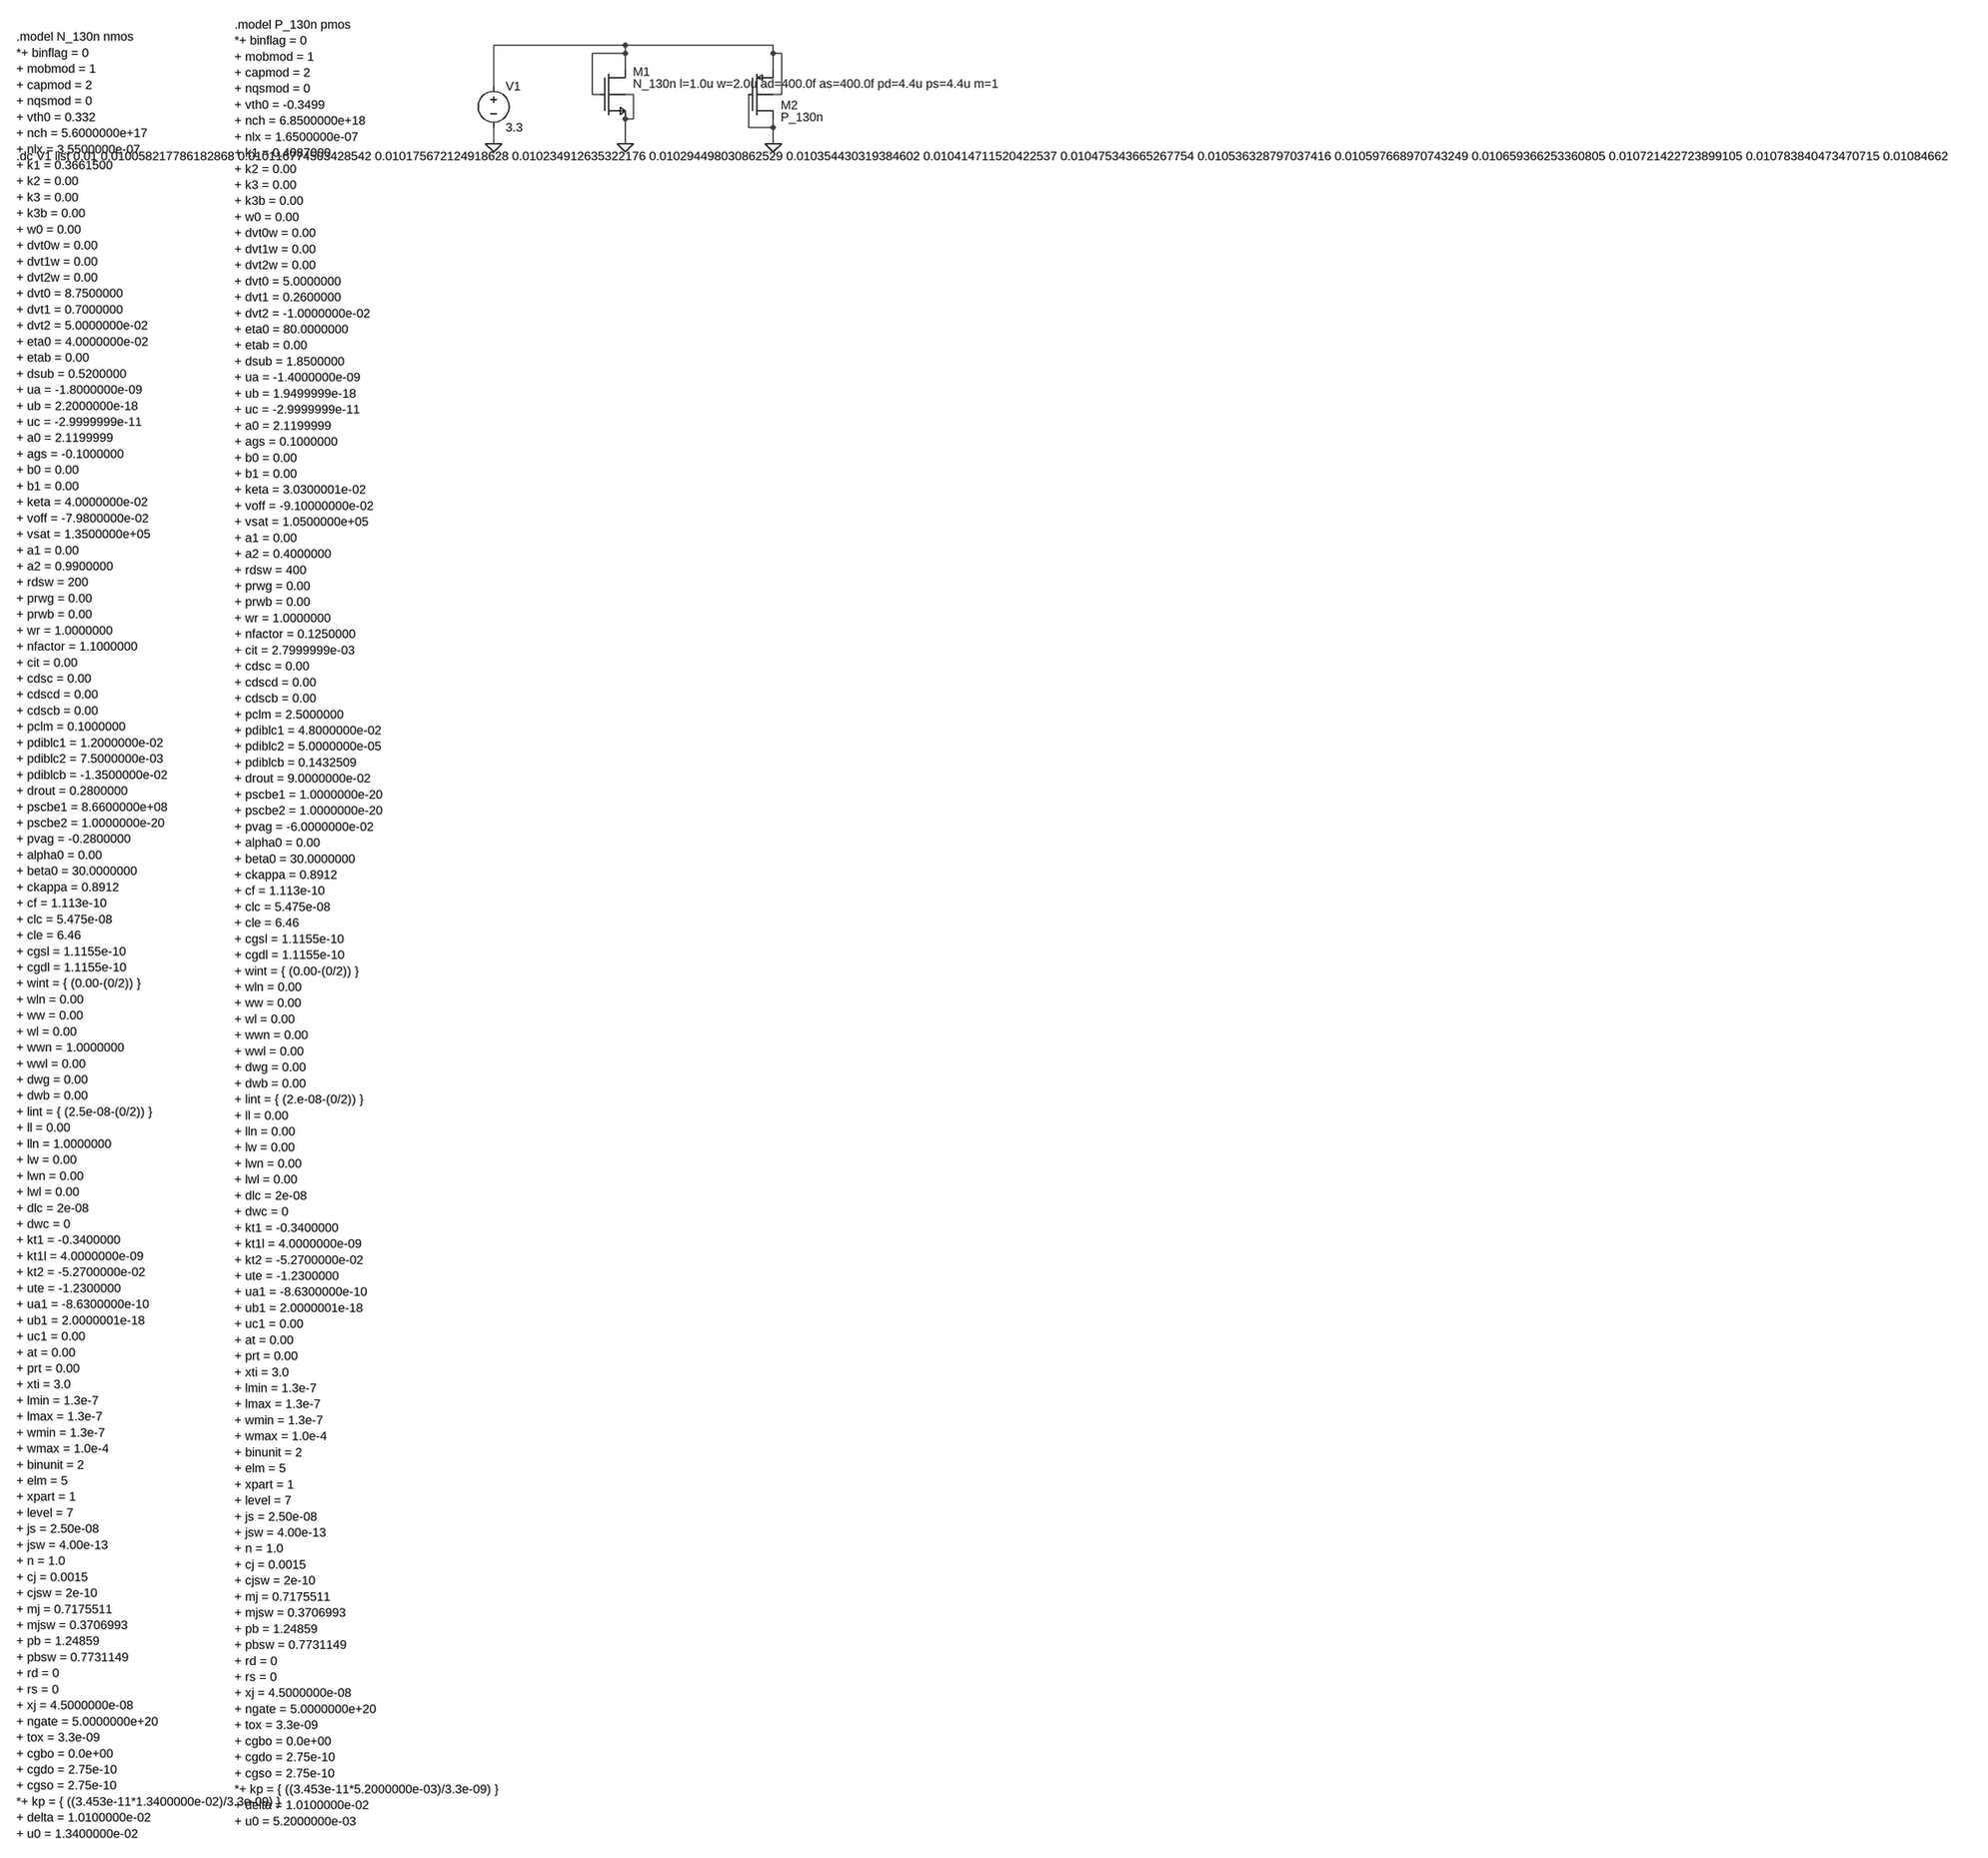
[diagram p0: schematic ekvParameterExtractionEdited.asc]
ekvParameterExtractionEdited.asc, the LTspice schematic file:
Version 4
SHEET 1 880 3184
WIRE 272 32 16 32
WIRE 560 32 272 32
WIRE 272 48 272 32
WIRE 272 48 208 48
WIRE 560 48 560 32
WIRE 576 48 560 48
WIRE 272 80 272 48
WIRE 560 80 560 48
WIRE 16 112 16 32
WIRE 208 128 208 48
WIRE 224 128 208 128
WIRE 288 128 272 128
WIRE 576 128 576 48
WIRE 576 128 560 128
WIRE 288 176 288 128
WIRE 288 176 272 176
WIRE 512 192 512 128
WIRE 560 192 560 176
WIRE 560 192 512 192
WIRE 16 224 16 192
WIRE 272 224 272 176
WIRE 560 224 560 192
FLAG 16 224 0
FLAG 272 224 0
FLAG 560 224 0
SYMBOL voltage 16 96 R0
WINDOW 123 0 0 Left 0
WINDOW 39 0 0 Left 0
SYMATTR InstName V1
SYMATTR Value 3.3
SYMBOL nmosb 224 80 R0
SYMATTR InstName M1
SYMATTR Value2 l=1.0u w=2.0u ad=400.0f as=400.0f pd=4.4u ps=4.4u m=1
SYMATTR Value N_130n l=1.0u w=2.0u ad=400.0f as=400.0f pd=4.4u ps=4.4u m=1
SYMBOL pmosb 512 80 R0
WINDOW 0 63 69 Left 2
SYMATTR InstName M2
SYMATTR Value2 l=1.0u w=6.0u ad=1.2p as=1.2p pd=12.4u ps=12.4u m=1
SYMATTR Value P_130n
TEXT -912 16 Left 2 !.model N_130n nmos \n*+ binflag = 0 \n+ mobmod = 1 \n+ capmod = 2 \n+ nqsmod = 0 \n+ vth0 = 0.332 \n+ nch = 5.6000000e+17 \n+ nlx = 3.5500000e-07 \n+ k1 = 0.3661500 \n+ k2 = 0.00 \n+ k3 = 0.00 \n+ k3b = 0.00 \n+ w0 = 0.00 \n+ dvt0w = 0.00 \n+ dvt1w = 0.00 \n+ dvt2w = 0.00 \n+ dvt0 = 8.7500000 \n+ dvt1 = 0.7000000 \n+ dvt2 = 5.0000000e-02 \n+ eta0 = 4.0000000e-02 \n+ etab = 0.00 \n+ dsub = 0.5200000 \n+ ua = -1.8000000e-09 \n+ ub = 2.2000000e-18 \n+ uc = -2.9999999e-11 \n+ a0 = 2.1199999 \n+ ags = -0.1000000 \n+ b0 = 0.00 \n+ b1 = 0.00 \n+ keta = 4.0000000e-02 \n+ voff = -7.9800000e-02 \n+ vsat = 1.3500000e+05 \n+ a1 = 0.00 \n+ a2 = 0.9900000 \n+ rdsw = 200 \n+ prwg = 0.00 \n+ prwb = 0.00 \n+ wr = 1.0000000 \n+ nfactor = 1.1000000 \n+ cit = 0.00 \n+ cdsc = 0.00 \n+ cdscd = 0.00 \n+ cdscb = 0.00 \n+ pclm = 0.1000000 \n+ pdiblc1 = 1.2000000e-02 \n+ pdiblc2 = 7.5000000e-03 \n+ pdiblcb = -1.3500000e-02 \n+ drout = 0.2800000 \n+ pscbe1 = 8.6600000e+08 \n+ pscbe2 = 1.0000000e-20 \n+ pvag = -0.2800000 \n+ alpha0 = 0.00 \n+ beta0 = 30.0000000 \n+ ckappa = 0.8912 \n+ cf = 1.113e-10 \n+ clc = 5.475e-08 \n+ cle = 6.46 \n+ cgsl = 1.1155e-10 \n+ cgdl = 1.1155e-10 \n+ wint = { (0.00-(0/2)) } \n+ wln = 0.00 \n+ ww = 0.00 \n+ wl = 0.00 \n+ wwn = 1.0000000 \n+ wwl = 0.00 \n+ dwg = 0.00 \n+ dwb = 0.00 \n+ lint = { (2.5e-08-(0/2)) } \n+ ll = 0.00 \n+ lln = 1.0000000 \n+ lw = 0.00 \n+ lwn = 0.00 \n+ lwl = 0.00 \n+ dlc = 2e-08 \n+ dwc = 0 \n+ kt1 = -0.3400000 \n+ kt1l = 4.0000000e-09 \n+ kt2 = -5.2700000e-02 \n+ ute = -1.2300000 \n+ ua1 = -8.6300000e-10 \n+ ub1 = 2.0000001e-18 \n+ uc1 = 0.00 \n+ at = 0.00 \n+ prt = 0.00 \n+ xti = 3.0 \n+ lmin = 1.3e-7 \n+ lmax = 1.3e-7 \n+ wmin = 1.3e-7 \n+ wmax = 1.0e-4 \n+ binunit = 2 \n+ elm = 5\n+ xpart = 1 \n+ level = 7 \n+ js = 2.50e-08 \n+ jsw = 4.00e-13 \n+ n = 1.0 \n+ cj = 0.0015 \n+ cjsw = 2e-10 \n+ mj = 0.7175511 \n+ mjsw = 0.3706993 \n+ pb = 1.24859 \n+ pbsw = 0.7731149 \n+ rd = 0 \n+ rs = 0 \n+ xj = 4.5000000e-08 \n+ ngate = 5.0000000e+20 \n+ tox = 3.3e-09 \n+ cgbo = 0.0e+00 \n+ cgdo = 2.75e-10 \n+ cgso = 2.75e-10 \n*+ kp = { ((3.453e-11*1.3400000e-02)/3.3e-09) } \n+ delta = 1.0100000e-02 \n+ u0 = 1.3400000e-02
TEXT -488 -8 Left 2 !.model P_130n pmos \n*+ binflag = 0 \n+ mobmod = 1 \n+ capmod = 2 \n+ nqsmod = 0 \n+ vth0 = -0.3499 \n+ nch = 6.8500000e+18 \n+ nlx = 1.6500000e-07 \n+ k1 = 0.4087000 \n+ k2 = 0.00 \n+ k3 = 0.00 \n+ k3b = 0.00 \n+ w0 = 0.00 \n+ dvt0w = 0.00 \n+ dvt1w = 0.00 \n+ dvt2w = 0.00 \n+ dvt0 = 5.0000000 \n+ dvt1 = 0.2600000 \n+ dvt2 = -1.0000000e-02 \n+ eta0 = 80.0000000 \n+ etab = 0.00 \n+ dsub = 1.8500000 \n+ ua = -1.4000000e-09 \n+ ub = 1.9499999e-18 \n+ uc = -2.9999999e-11 \n+ a0 = 2.1199999 \n+ ags = 0.1000000 \n+ b0 = 0.00 \n+ b1 = 0.00 \n+ keta = 3.0300001e-02 \n+ voff = -9.10000000e-02 \n+ vsat = 1.0500000e+05 \n+ a1 = 0.00 \n+ a2 = 0.4000000 \n+ rdsw = 400 \n+ prwg = 0.00 \n+ prwb = 0.00 \n+ wr = 1.0000000 \n+ nfactor = 0.1250000 \n+ cit = 2.7999999e-03 \n+ cdsc = 0.00 \n+ cdscd = 0.00 \n+ cdscb = 0.00 \n+ pclm = 2.5000000 \n+ pdiblc1 = 4.8000000e-02 \n+ pdiblc2 = 5.0000000e-05 \n+ pdiblcb = 0.1432509 \n+ drout = 9.0000000e-02 \n+ pscbe1 = 1.0000000e-20 \n+ pscbe2 = 1.0000000e-20 \n+ pvag = -6.0000000e-02 \n+ alpha0 = 0.00 \n+ beta0 = 30.0000000 \n+ ckappa = 0.8912 \n+ cf = 1.113e-10 \n+ clc = 5.475e-08 \n+ cle = 6.46 \n+ cgsl = 1.1155e-10 \n+ cgdl = 1.1155e-10 \n+ wint = { (0.00-(0/2)) } \n+ wln = 0.00 \n+ ww = 0.00 \n+ wl = 0.00 \n+ wwn = 0.00 \n+ wwl = 0.00 \n+ dwg = 0.00 \n+ dwb = 0.00 \n+ lint = { (2.e-08-(0/2)) } \n+ ll = 0.00 \n+ lln = 0.00 \n+ lw = 0.00 \n+ lwn = 0.00 \n+ lwl = 0.00 \n+ dlc = 2e-08 \n+ dwc = 0 \n+ kt1 = -0.3400000 \n+ kt1l = 4.0000000e-09 \n+ kt2 = -5.2700000e-02 \n+ ute = -1.2300000 \n+ ua1 = -8.6300000e-10 \n+ ub1 = 2.0000001e-18 \n+ uc1 = 0.00 \n+ at = 0.00 \n+ prt = 0.00 \n+ xti = 3.0 \n+ lmin = 1.3e-7 \n+ lmax = 1.3e-7 \n+ wmin = 1.3e-7 \n+ wmax = 1.0e-4 \n+ binunit = 2 \n+ elm = 5 \n+ xpart = 1 \n+ level = 7 \n+ js = 2.50e-08 \n+ jsw = 4.00e-13 \n+ n = 1.0 \n+ cj = 0.0015 \n+ cjsw = 2e-10 \n+ mj = 0.7175511 \n+ mjsw = 0.3706993 \n+ pb = 1.24859 \n+ pbsw = 0.7731149 \n+ rd = 0 \n+ rs = 0 \n+ xj = 4.5000000e-08 \n+ ngate = 5.0000000e+20 \n+ tox = 3.3e-09 \n+ cgbo = 0.0e+00 \n+ cgdo = 2.75e-10 \n+ cgso = 2.75e-10 \n*+ kp = { ((3.453e-11*5.2000000e-03)/3.3e-09) } \n+ delta = 1.0100000e-02 \n+ u0 = 5.2000000e-03
TEXT -912 248 Left 2 !.dc V1 list 0.01 0.010058217786182868 0.010116774503428542 0.010175672124918628 0.010234912635322176 0.010294498030862529 0.010354430319384602 0.010414711520422537 0.010475343665267754 0.010536328797037416 0.010597668970743249 0.010659366253360805 0.010721422723899105 0.010783840473470715 0.010846621605362185 0.01090976823510493 0.010973282490546531 0.011037166511922412 0.011101422451927993 0.011166052475791197 0.011231058761345428 0.011296443499102953 0.011362208892328711 0.01142835715711458 0.011494890522454016 0.011561811230317187 0.011629121535726511 0.011696823706832664 0.011764920024990974 0.011833412784838323 0.011902304294370456 0.01197159687501976 0.0120412928617335 0.012111394603052472 0.012181904461190158 0.01225282481211233 0.012324158045617093 0.012395906565415456 0.012468072789212274 0.012540659148787756 0.012613668090079392 0.012687102073264378 0.01276096357284253 0.012835255077719643 0.01290997909129137 0.012985138131527582 0.013060734731057205 0.013136771437253591 0.013213250812320316 0.013290175433377543 0.013367547892548863 0.013445370797048623 0.01352364676926982 0.013602378446872421 0.01368156848287227 0.013761219545730476 0.013841334319443361 0.013921915503632858 0.014002965813637504 0.014084487980603935 0.014166484751578935 0.014248958889601964 0.014331913173798297 0.01441535039947266 0.014499273378203417 0.014583684937937338 0.014668587923084855 0.014753985194615932 0.014839879630156469 0.014926274124085257 0.015013171587631546 0.015100574948973091 0.015188487153334863 0.015276911163088273 0.015365849957851 0.015455306534587421 0.015545283907709553 0.015635785109178655 0.015726813188607403 0.01581837121336262 0.0159104622686687 0.016003089457711495 0.016096255901742934 0.016189964740186174 0.016284219130741403 0.01637902224949225 0.01647437729101279 0.0165702874684752 0.016666756013758038 0.01676378617755513 0.016861381229485155 0.016959544458201754 0.0170582791715044 0.017157588696449823 0.017257476379464176 0.01735794558645573 0.017458999702928347 0.017560642134095524 0.01766287630499519 0.017765705660605056 0.01786913366595875 0.017973163806262536 0.018077799587012795 0.01818304453411414 0.018288902193998206 0.018395376133743164 0.018502469941193936 0.018610187225083067 0.01871853161515237 0.01882750676227519 0.01893711633857946 0.019047364037571412 0.019158253574260063 0.01926978868528241 0.019381973129029294 0.019494810685772086 0.019608305157790065 0.019722460369498523 0.01983728016757768 0.019952768421102253 0.020068929021671855 0.02018576588354214 0.020303282943756683 0.020421484162279673 0.02054037352212932 0.020659955029512077 0.02078023271395766 0.020901210628454795 0.021022892849587842 0.02114528347767411 0.02126838663690204 0.021392206475470212 0.021516747165727084 0.0216420129043116 0.02176800791229461 0.021894736435321097 0.022022202743753275 0.02215041113281444 0.02227936592273372 0.022409071458891684 0.02253953211196671 0.02267075227808235 0.022802736378955368 0.022935488862044804 0.023069014200701815 0.023203316894320404 0.023338401468489096 0.023474272475143342 0.02361093449271897 0.023748392126306455 0.023886650007806067 0.024025712796084016 0.02416558517712936 0.024306271864211963 0.0244477775980413 0.0245901071469262 0.024733265306935558 0.024877256902059892 0.025022086784373936 0.025167759834200124 0.025314280960273036 0.025461655099904862 0.025609887219151684 0.025758982312980867 0.025908945405439424 0.02605978154982316 0.02621149582884715 0.026364093354816848 0.026517579269800425 0.02667195874580208 0.02682723698493622 0.026983419219602837 0.027140510712663792 0.027298516757620152 0.027457442678790613 0.027617293831490832 0.02777807560221395 0.02793979340881208 0.02810245270067884 0.028266058958933072 0.028430617696603426 0.0285961344588142 0.028762614822972182 0.02893006439895457 0.029098488829298066 0.029267893789388936 0.02943828498765429 0.029609668165754454 0.029782049098776398 0.029955433595428425 0.030129827498235805 0.030305236683737708 0.030481667062685215 0.03065912458024048 0.03083761521617712 0.031017144985081617 0.03119771993655607 0.03137934615542202 0.03156202976192546 0.03174577691194317 0.03193059379719003 0.0321164866454277 0.03230346172067456 0.03249152532341662 0.032680683790820016 0.03287094349694441 0.03306231085295782 0.03325479230735274 0.033448394346163236 0.03364312349318376 0.033838986310188765 0.03403598939715391 0.03423413939247852 0.034433442973209084 0.03463390685526451 0.03483553779366223 0.035038342582745886 0.03524232805641433 0.03544750108835181 0.03565386859225968 0.035861437522089305 0.03607021487227642 0.03628020767797686 0.03649142301530351 0.03670386800156487 0.0369175497955048 0.0371324755975438 0.03734865265002164 0.037566088237441356 0.037784789686714754 0.038004764367409356 0.03822601969199655 0.03844856311610163 0.03867240213875481 0.038897544302643985 0.039123997194369 0.03935176844469708 0.03958086572882019 0.039811296766613526 0.04004306932289565 0.040276191207690284 0.040510670276489226 0.04074651443051736 0.04098373161699867 0.0412223298294241 0.041462317107821035 0.04170370153902395 0.041946491256947264 0.04219069444285912 0.04243631932565721 0.04268337418214614 0.042931867337316076 0.043181807164623595 0.04343320208627359 0.04368606057350317 0.04394039114686717 0.04419620237652517 0.044453502882530305 0.044712301335119775 0.044972606455006954 0.045234427013675346 0.04549777183367402 0.04576264978891498 0.046029069804972254 0.04629704085938245 0.046566571981947566 0.04683767225503899 0.047110350813903676 0.04738461684697208 0.047660479596167475 0.04793794835721774 0.048217032479968336 0.04849774136869744 0.04878008448243295 0.049064071335270985 0.049349711496696765 0.049637014591906864 0.0499259903021336 0.05021664836497138 0.05050899857470458 0.05080305078263788 0.051098814897427985 0.051396300885417606 0.0516955187709714 0.05199647863681346 0.05229919062436748 0.05260366493409813 0.052909911825854965 0.05321794161921817 0.053527764693846173 0.0538393914898255 0.054152832508022546 0.0544680983104374 0.05478519952055985 0.055104146823727225 0.055424950967484544 0.05574762276194665 0.05607217308016244 0.05639861285848142 0.05672695309692197 0.05705720485954216 0.05738937927481269 0.05772348753599152 0.058059540901501505 0.05839755069530943 0.05873752830730767 0.05907948519369821 0.05942343287737825 0.059769382948328974 0.06011734706400576 0.06046733694973109 0.06081936439908982 0.06117344127432621 0.061529579506744106 0.06188779109710866 0.06224808811605078 0.06261048270447407 0.06297498707396357 0.06334161350719766 0.06371037435836166 0.0640812820535642 0.06445434909125608 0.06482958804265113 0.06520701155215018 0.06558663233776688 0.06596846319155629 0.06635251698004614 0.06673880664467009 0.06712734520220402 0.06751814574520458 0.06791122144245035 0.06830658553938576 0.06870425135856714 0.06910423230011185 0.06950654184214979 0.06991119354127744 0.07031820103301496 0.07072757803226537 0.0711393383337768 0.07155349581260749 0.07197006442459297 0.0723890582068168 0.07281049127808317 0.07323437783939285 0.0736607321744218 0.07408956865000217 0.07452090171660686 0.07495474590883607 0.07539111584590721 0.07583002623214774 0.07627149185749016 0.07671552759797094 0.07716214841623141 0.07761136936202206 0.07806320557270989 0.07851767227378799 0.07897478477938918 0.07943455849280165 0.07989700890698806 0.08036215160510789 0.08083000226104199 0.0813005766399214 0.0817738905986581 0.08224996008647946 0.08272880114546587 0.08321042991109105 0.0836948626127659 0.08418211557438536 0.08467220521487843 0.08516514804876162 0.08566096068669514 0.08615965983604282 0.0866612623014352 0.0871657849853354 0.08767324488860923 0.08818365911109756 0.0886970448521928 0.08921341941141858 0.0897328001890122 0.0902552046865116 0.09078065050734464 0.09130915535742243 0.09184073704573616 0.09237541348495669 0.09291320269203882 0.09345412278882789 0.0939981920026706 0.09454542866702942 0.09509585122209986 0.09564947821543247 0.09620632830255738 0.09676642024761305 0.09732977292397882 0.0978964053149103 0.0984663365141798 0.09903958572671909 0.09961617226926685 0.10019611557101965 0.10077943517428642 0.10136615073514711 0.10195628202411504 0.10254984892680301 0.10314687144459363 0.10374736969531295 0.10435136391390863 0.10495887445313169 0.10556992178422235 0.10618452649759995 0.1068027093035566 0.10742449103295516 0.10804989263793117 0.10867893519259882 0.10931163989376128 0.10994802806162465 0.11058812114051664 0.11123194069960896 0.1118795084336445 0.11253084616366794 0.11318597583776131 0.11384491953178354 0.1145076994501142 0.11517433792640211 0.11584485742431738 0.11651928053830878 0.11719762999436487 0.1178799286507799 0.1185661994989242 0.11925646566401858 0.11995075040591383 0.12064907711987445 0.12135146933736692 0.1220579507268529 0.12276854509458641 0.12348327638541627 0.12420216868359284 0.12492524621357984 0.1256525333408703 0.12638405457280774 0.12711983455941211 0.12785989809421022 0.12860427011507142 0.12935297570504775 0.1301060400932192 0.13086348865554387 0.13162534691571307 0.13239164054601157 0.13316239536818225 0.13393763735429662 0.13471739262762972 0.13550168746354055 0.13629054829035758 0.137084001690269 0.1378820744002186 0.13868479331280678 0.1394921854771968 0.14030427810002608 0.141121098546323 0.14194267434042912 0.14276903316692663 0.14360020287157133 0.1444362114622307 0.1452770871098279 0.14612285814929088 0.14697355308050733 0.14782920056928509 0.1486898294483178 0.14955546871815673 0.1504261475481879 0.1513018952776152 0.15218274141644872 0.1530687156464993 0.1539598478223787 0.15485616797250565 0.15575770630011784 0.15666449318428927 0.15757655918095434 0.15849393502393724 0.15941665162598767 0.16034474007982272 0.1612782316591742 0.16221715781984272 0.16316155020075754 0.1641114406250428 0.16506686110108992 0.16602784382363597 0.1669944211748487 0.16796662572541754 0.16894449023565158 0.16992804765658287 0.1709173311310772 0.1719123739949508 0.17291320977809344 0.1739198722055989 0.17493239519890066 0.17595081287691533 0.17697515955719237 0.17800546975707024 0.17904177819484007 0.18008411979091485 0.18113252966900661 0.18218704315730988 0.1832476957896919 0.1843145233068907 0.1853875616577185 0.18646684700027374 0.18755241570315923 0.18864430434670793 0.1897425497242152 0.19084718884317886 0.19195825892654625 0.1930757974139683 0.19419984196306164 0.19533043045067688 0.19646760097417543 0.197611391852713 0.19876184162853094 0.19991898906825525 0.20108287316420234 0.20225353313569341 0.20343100843037576 0.20461533872555215 0.20580656392951813 0.20700472418290608 0.2082098598600385 0.20942201157028809 0.2106412201594466 0.21186752671110076 0.21310097254801677 0.21434159923353296 0.21558944857296006 0.21684456261499038 0.21810698365311412 0.21937675422704486 0.22065391712415305 0.2219385153809076 0.22323059228432648 0.2245301913734349 0.22583735644073263 0.22715213153366973 0.22847456095613064 0.22980468926992753 0.23114256129630126 0.23248822211743214 0.2338417170779588 0.23520309178650678 0.23657239211722444 0.2379496642113295 0.23933495447866354 0.24072830959925598 0.24212977652489728 0.2435394024807205 0.24495723496679314 0.2463833217597175 0.2478177109142406 0.24926045076487394 0.2507115899275214 0.2521711773011182 0.25363926206927806 0.2551158937019509 0.2566011219570901 0.25809499688232834 0.2595975688166647 0.2611088883921607 0.26262900653564686 0.264157974470438 0.26569584371806 0.2672426660999855 0.2687984937393802 0.2703633790628599 0.2719373748022558 0.2735205339963927 0.2751129099928753 0.27671455644988635 0.27832552733799504 0.2799458769419748 0.28157565986263317 0.28321493101865136 0.28486374564843536 0.2865221593119765 0.28819022789272436 0.28986800759946946 0.2915555549682373 0.2932529268641942 0.2949601804835622 0.29667737335554745 0.29840456334427834 0.3001418086507551 0.30188916781481206 0.30364669971708874 0.3054144635810151 0.3071925189748066 0.3089809258134717 0.31077974436083106 0.3125890352315476 0.31440885939316954 0.31623927816818453 0.3180803532360865 0.31993214663545355 0.32179472076603843 0.3236681383908718 0.32555246263837634 0.3274477570044951 0.32935408535482985 0.33127151192679405 0.333200101331777 0.3351399185573212 0.33709102896931264 0.3390534983141825 0.3410273927211234 0.3430127787043174 0.3450097231651772 0.34701829339460133 0.3490385570752404 0.35107058228377874 0.3531144374932278 0.3551701915752343 0.3572379138023999 0.3593176738506161 0.3614095418014122 0.36351358814431634 0.36562988377923167 0.3677585000188243 0.3698995085909272 0.3720529816409567 0.3742189917343437 0.3763976118589796 0.3785889154276745 0.38079297628063175 0.38300986868793613 0.3852396673520563 0.3874824474103624 0.38973828443765757 0.39200725444872453 0.3942894339008873 0.3965848996965879 0.39889372918597693 0.4012160001695206 0.4035517909006221 0.40590118008825854 0.4082642468996338 0.4106410709628451 0.41303173236956703 0.41543631167775014 0.41785488991433545 0.42028754857798534 0.42273436964182887 0.4251954355562247 0.4276708292515391 0.4301606341409405 0.432664934123211 0.435183813585572 0.43771735740652906 0.4402656509587312 0.4428287801118489 0.44540683123546615 0.44799989120199174 0.4506080473895863 0.4532313876851068 0.4558700004870685 0.45852397470862255 0.4611933997805531 0.4638783656542906 0.4665789628049424 0.4692952822343427 0.4720274154741175 0.47477545458876996 0.4775394921787823 0.4803196213837361 0.48311593588545154 0.48592852991114316 0.4887574982365954 0.4916029361893564 0.49446493965195065 0.4973436050651089 0.5002390294310187 0.5031513103165928 0.5060805458567567 0.5090268347577566 0.5119902763004835 0.5149709703438204 0.5179690173280066 0.5209845182780216 0.5240175748069911 0.527068289119609 0.5301367640155826 0.5332231028930964 0.5363274097522956 0.5394497891987928 0.5425903464471897 0.5457491873246249 0.5489264182743385 0.5521221463592609 0.5553364792656179 0.5585695253065612 0.5618213934258176 0.56509219320136 0.5683820348491004 0.5716910292266033 0.5750192878368212 0.5783669228318522 0.5817340470167187 0.5851207738531702 0.5885272174635041 0.591953492634413 0.5953997148208523 0.5988660001499302 0.602352465424822 0.6058592281287046 0.6093864064287161 0.6129341191799372 0.6165024859293975 0.620091626920102 0.6237016630950842 0.6273327161014811 0.6309849082946323 0.6346583627422037 0.6383532032283332 0.6420695542578029 0.645807541060234 0.6495672895943065 0.6533489265520053 0.6571525793628864 0.6609783761983734 0.6648264459760748 0.6686969183641299 0.6725899237855766 0.6765055934227466 0.6804440592216867 0.6844054538966036 0.6883899109343378 0.6923975645988597 0.6964285499357953 0.7004830027769761 0.704561059745016 0.7086628582579172 0.7127885365336972 0.716938233595049 0.7211120892740251 0.7253102442167485 0.729532839888154 0.733780018576753 0.7380519233994293 0.7423486983062613 0.7466704880853737 0.7510174383678151 0.7553896956324654 0.7597874072109727 0.7642107212927168 0.7686597869298044 0.7731347540420893 0.777635773422226 0.7821629967407505 0.7867165765511906 0.7912966662952082 0.7959034203077674 0.8005369938223366 0.8051975429761191 0.8098852248153143 0.8146001973004106 0.8193426193115064 0.8241126506536653 0.8289104520623002 0.8337361852085909 0.8385900127049305 0.8434720981104049 0.8483826059363058 0.8533217016516718 0.8582895516888677 0.863286323449189 0.8683121853085051 0.873367306622932 0.8784518577345398 0.8835660099770932 0.8887099356818229 0.8938838081832344 0.8990878018249485 0.9043220919655751 0.9095868549846248 0.9148822682884491 0.9202085103162206 0.9255657605459447 0.9309541995005096 0.9363740087537661 0.9418253709366483 0.9473084697433275 0.9528234899374007 0.9583706173581199 0.9639500389266498 0.9695619426523698 0.9752065176392081 0.9808839540920136 0.9865944433229672 0.9923381777580255 0.998115350943407 1.0039261575521128 1.009770793390489 1.0156494554048199 1.0215623416879698 1.0275096514860564 1.033491585205161 1.0395083444180884 1.0455601318711518 1.051647151491012 1.0577696083915453 1.0639277088807524 1.0701216604677177 1.076351671869594 1.082617953018641 1.0889207150692992 1.0952601704052987 1.1016365326468263 1.1080500166577125 1.1145008385526824 1.1209892157046317 1.1275153667519506 1.1340795116058977 1.1406818714580016 1.1473226687875226 1.1540021273689463 1.16072047227952 1.1674779299068452 1.1742747279564982 1.1811110954597095 1.1879872627810788 1.1949034616263343 1.2018599250501467 1.2088568874639802 1.2158945846439864 1.2229732537389582 1.2300931332783118 1.2372544631801323 1.244457484759255 1.251702440735393 1.2589895752413245 1.26631913383111 1.2736913634883749 1.2811065126346288 1.2885648311376325 1.2960665703198269 1.3036119829667905 1.3112013233357684 1.3188348471642348 1.3265128116785065 1.3342354756024208 1.3420030991660423 1.3498159441144413 1.3576742737165102 1.3655783527738303 1.3735284476296052 1.3815248261776234 1.3895677578712962 1.3976575137327327 1.4057943663618693 1.4139785899456638 1.4222104602673242 1.4304902547156118 1.4388182522941837 1.44719473363099 1.4556199809877413 1.464094278269406 1.4726179110337903 1.481191166501154 1.489814333563885 1.4984877027962438 1.5072115664641497 1.5159862185350246 1.5248119546877101 1.5336890723224186 1.5426178705707647 1.5515986503058417 1.5606317141523542 1.5697173664968278 1.5788559134978517 1.5880476630964087 1.5972929250262446 1.6065920108243026 1.6159452338412308 1.6253529092519294 1.634815354066182 1.6443328871393326 1.6539058291830253 1.663534502776024 1.6732192323750672 1.6829603443258139 1.6927581668738356 1.7026130301756714 1.7125252663099657 1.7224952092886443 1.7325231950681816 1.7426095615609165 1.7527546486464334 1.762958798183027 1.773222354019209 1.7835456620053054 1.7939290700051072 1.8043729279075853 1.8148775876386942 1.8254434031732165 1.8360707305467023 1.8467599278674625 1.8575113553286293 1.8683253752203057 1.879202351941767 1.8901426520137352 1.9011466440907419 1.9122146989735362 1.9233471896215935 1.9345444911656755 1.9458069809204677 1.9571350383973047 1.9685290453169453 1.9799893856224473 1.9915164454921002 2.003110613352432 2.0147722798913117 2.026501838071099 2.0382996831418994 2.0501662126548768 2.062101826475644 2.0741069267977514 2.0861819181562224 2.0983272074412 2.110543203911652 2.1228303192091547 2.1351889673717785 2.1476195648480245 2.16012253051087 2.1726982856718795 2.1853472540953915 2.1980698620128174 2.210866538136983 2.223737713676594 2.2366838223507557 2.2497053004035843 2.2628025866189194 2.275976122335103 2.289226351459844 2.302553720485193 2.3159586785025694 2.3294416772179107 2.3430031709668855 2.3566436167301976 2.370363474149001 2.3841632055403688 2.398043275912889 2.4120041529823264 2.426046307187377 2.4401702117055355 2.4543763424690224 2.4686651781808364 2.4830372003308803 2.497492893212176 2.512032743937204 2.526657242454293 2.5413668815641515 2.5561621569364656 2.571043567126591 2.586011613592374 2.6010668007110263 2.6162096357961406 2.631440629114776 2.6467602939046464 2.6621691463914328 2.677667705806156 2.693256494402694 2.7089360374753717 2.7247068633766514 2.7405695035349584 2.756524492472566 2.7725723678236256 2.7887136703522755 2.8049489439708557 2.82127873575825 2.8377035959783163 2.8542240780984174 2.870840738808092 2.8875541380377903 2.904364838977763 2.9212734080970297 2.9382804151624575 2.955386433257983 2.972592038803898 2.989897811576295 3.0073043347265944 3.0248121948011857 3.042421981761214 3.060134289002436 3.0779497133752356 3.0958688552047273 3.113892318310977 3.1320207100293693 3.1502546412310486 3.168594726343525 3.18704158337137 3.205595833917031 3.2242581032018003 3.2430290200868575 3.2619092170944812 3.2808993304293566 3.2999999999999994

The netlist it stands for:
* ekvParameterExtractionEdited.asc
V1 N001 0 3.3
M1 N001 N001 0 0 N_130n l=1.0u w=2.0u ad=400.0f as=400.0f pd=4.4u ps=4.4u m=1 l=1.0u w=2.0u ad=400.0f as=400.0f pd=4.4u ps=4.4u m=1
M2 0 0 N001 N001 P_130n l=1.0u w=6.0u ad=1.2p as=1.2p pd=12.4u ps=12.4u m=1
.model NMOS NMOS
.model PMOS PMOS
.lib standard.mos
.model N_130n nmos
*+ binflag = 0
+ mobmod = 1
+ capmod = 2
+ nqsmod = 0
+ vth0 = 0.332
+ nch = 5.6000000e+17
+ nlx = 3.5500000e-07
+ k1 = 0.3661500
+ k2 = 0.00
+ k3 = 0.00
+ k3b = 0.00
+ w0 = 0.00
+ dvt0w = 0.00
+ dvt1w = 0.00
+ dvt2w = 0.00
+ dvt0 = 8.7500000
+ dvt1 = 0.7000000
+ dvt2 = 5.0000000e-02
+ eta0 = 4.0000000e-02
+ etab = 0.00
+ dsub = 0.5200000
+ ua = -1.8000000e-09
+ ub = 2.2000000e-18
+ uc = -2.9999999e-11
+ a0 = 2.1199999
+ ags = -0.1000000
+ b0 = 0.00
+ b1 = 0.00
+ keta = 4.0000000e-02
+ voff = -7.9800000e-02
+ vsat = 1.3500000e+05
+ a1 = 0.00
+ a2 = 0.9900000
+ rdsw = 200
+ prwg = 0.00
+ prwb = 0.00
+ wr = 1.0000000
+ nfactor = 1.1000000
+ cit = 0.00
+ cdsc = 0.00
+ cdscd = 0.00
+ cdscb = 0.00
+ pclm = 0.1000000
+ pdiblc1 = 1.2000000e-02
+ pdiblc2 = 7.5000000e-03
+ pdiblcb = -1.3500000e-02
+ drout = 0.2800000
+ pscbe1 = 8.6600000e+08
+ pscbe2 = 1.0000000e-20
+ pvag = -0.2800000
+ alpha0 = 0.00
+ beta0 = 30.0000000
+ ckappa = 0.8912
+ cf = 1.113e-10
+ clc = 5.475e-08
+ cle = 6.46
+ cgsl = 1.1155e-10
+ cgdl = 1.1155e-10
+ wint = { (0.00-(0/2)) }
+ wln = 0.00
+ ww = 0.00
+ wl = 0.00
+ wwn = 1.0000000
+ wwl = 0.00
+ dwg = 0.00
+ dwb = 0.00
+ lint = { (2.5e-08-(0/2)) }
+ ll = 0.00
+ lln = 1.0000000
+ lw = 0.00
+ lwn = 0.00
+ lwl = 0.00
+ dlc = 2e-08
+ dwc = 0
+ kt1 = -0.3400000
+ kt1l = 4.0000000e-09
+ kt2 = -5.2700000e-02
+ ute = -1.2300000
+ ua1 = -8.6300000e-10
+ ub1 = 2.0000001e-18
+ uc1 = 0.00
+ at = 0.00
+ prt = 0.00
+ xti = 3.0
+ lmin = 1.3e-7
+ lmax = 1.3e-7
+ wmin = 1.3e-7
+ wmax = 1.0e-4
+ binunit = 2
+ elm = 5
+ xpart = 1
+ level = 7
+ js = 2.50e-08
+ jsw = 4.00e-13
+ n = 1.0
+ cj = 0.0015
+ cjsw = 2e-10
+ mj = 0.7175511
+ mjsw = 0.3706993
+ pb = 1.24859
+ pbsw = 0.7731149
+ rd = 0
+ rs = 0
+ xj = 4.5000000e-08
+ ngate = 5.0000000e+20
+ tox = 3.3e-09
+ cgbo = 0.0e+00
+ cgdo = 2.75e-10
+ cgso = 2.75e-10
*+ kp = { ((3.453e-11*1.3400000e-02)/3.3e-09) }
+ delta = 1.0100000e-02
+ u0 = 1.3400000e-02
.model P_130n pmos
*+ binflag = 0
+ mobmod = 1
+ capmod = 2
+ nqsmod = 0
+ vth0 = -0.3499
+ nch = 6.8500000e+18
+ nlx = 1.6500000e-07
+ k1 = 0.4087000
+ k2 = 0.00
+ k3 = 0.00
+ k3b = 0.00
+ w0 = 0.00
+ dvt0w = 0.00
+ dvt1w = 0.00
+ dvt2w = 0.00
+ dvt0 = 5.0000000
+ dvt1 = 0.2600000
+ dvt2 = -1.0000000e-02
+ eta0 = 80.0000000
+ etab = 0.00
+ dsub = 1.8500000
+ ua = -1.4000000e-09
+ ub = 1.9499999e-18
+ uc = -2.9999999e-11
+ a0 = 2.1199999
+ ags = 0.1000000
+ b0 = 0.00
+ b1 = 0.00
+ keta = 3.0300001e-02
+ voff = -9.10000000e-02
+ vsat = 1.0500000e+05
+ a1 = 0.00
+ a2 = 0.4000000
+ rdsw = 400
+ prwg = 0.00
+ prwb = 0.00
+ wr = 1.0000000
+ nfactor = 0.1250000
+ cit = 2.7999999e-03
+ cdsc = 0.00
+ cdscd = 0.00
+ cdscb = 0.00
+ pclm = 2.5000000
+ pdiblc1 = 4.8000000e-02
+ pdiblc2 = 5.0000000e-05
+ pdiblcb = 0.1432509
+ drout = 9.0000000e-02
+ pscbe1 = 1.0000000e-20
+ pscbe2 = 1.0000000e-20
+ pvag = -6.0000000e-02
+ alpha0 = 0.00
+ beta0 = 30.0000000
+ ckappa = 0.8912
+ cf = 1.113e-10
+ clc = 5.475e-08
+ cle = 6.46
+ cgsl = 1.1155e-10
+ cgdl = 1.1155e-10
+ wint = { (0.00-(0/2)) }
+ wln = 0.00
+ ww = 0.00
+ wl = 0.00
+ wwn = 0.00
+ wwl = 0.00
+ dwg = 0.00
+ dwb = 0.00
+ lint = { (2.e-08-(0/2)) }
+ ll = 0.00
+ lln = 0.00
+ lw = 0.00
+ lwn = 0.00
+ lwl = 0.00
+ dlc = 2e-08
+ dwc = 0
+ kt1 = -0.3400000
+ kt1l = 4.0000000e-09
+ kt2 = -5.2700000e-02
+ ute = -1.2300000
+ ua1 = -8.6300000e-10
+ ub1 = 2.0000001e-18
+ uc1 = 0.00
+ at = 0.00
+ prt = 0.00
+ xti = 3.0
+ lmin = 1.3e-7
+ lmax = 1.3e-7
+ wmin = 1.3e-7
+ wmax = 1.0e-4
+ binunit = 2
+ elm = 5
+ xpart = 1
+ level = 7
+ js = 2.50e-08
+ jsw = 4.00e-13
+ n = 1.0
+ cj = 0.0015
+ cjsw = 2e-10
+ mj = 0.7175511
+ mjsw = 0.3706993
+ pb = 1.24859
+ pbsw = 0.7731149
+ rd = 0
+ rs = 0
+ xj = 4.5000000e-08
+ ngate = 5.0000000e+20
+ tox = 3.3e-09
+ cgbo = 0.0e+00
+ cgdo = 2.75e-10
+ cgso = 2.75e-10
*+ kp = { ((3.453e-11*5.2000000e-03)/3.3e-09) }
+ delta = 1.0100000e-02
+ u0 = 5.2000000e-03
.dc V1 list 0.01 0.010058217786182868 0.010116774503428542 0.010175672124918628 0.010234912635322176 0.010294498030862529 0.010354430319384602 0.010414711520422537 0.010475343665267754 0.010536328797037416 0.010597668970743249 0.010659366253360805 0.010721422723899105 0.010783840473470715 0.010846621605362185 0.01090976823510493 0.010973282490546531 0.011037166511922412 0.011101422451927993 0.011166052475791197 0.011231058761345428 0.011296443499102953 0.011362208892328711 0.01142835715711458 0.011494890522454016 0.011561811230317187 0.011629121535726511 0.011696823706832664 0.011764920024990974 0.011833412784838323 0.011902304294370456 0.01197159687501976 0.0120412928617335 0.012111394603052472 0.012181904461190158 0.01225282481211233 0.012324158045617093 0.012395906565415456 0.012468072789212274 0.012540659148787756 0.012613668090079392 0.012687102073264378 0.01276096357284253 0.012835255077719643 0.01290997909129137 0.012985138131527582 0.013060734731057205 0.013136771437253591 0.013213250812320316 0.013290175433377543 0.013367547892548863 0.013445370797048623 0.01352364676926982 0.013602378446872421 0.01368156848287227 0.013761219545730476 0.013841334319443361 0.013921915503632858 0.014002965813637504 0.014084487980603935 0.014166484751578935 0.014248958889601964 0.014331913173798297 0.01441535039947266 0.014499273378203417 0.014583684937937338 0.014668587923084855 0.014753985194615932 0.014839879630156469 0.014926274124085257 0.015013171587631546 0.015100574948973091 0.015188487153334863 0.015276911163088273 0.015365849957851 0.015455306534587421 0.015545283907709553 0.015635785109178655 0.015726813188607403 0.01581837121336262 0.0159104622686687 0.016003089457711495 0.016096255901742934 0.016189964740186174 0.016284219130741403 0.01637902224949225 0.01647437729101279 0.0165702874684752 0.016666756013758038 0.01676378617755513 0.016861381229485155 0.016959544458201754 0.0170582791715044 0.017157588696449823 0.017257476379464176 0.01735794558645573 0.017458999702928347 0.017560642134095524 0.01766287630499519 0.017765705660605056 0.01786913366595875 0.017973163806262536 0.018077799587012795 0.01818304453411414 0.018288902193998206 0.018395376133743164 0.018502469941193936 0.018610187225083067 0.01871853161515237 0.01882750676227519 0.01893711633857946 0.019047364037571412 0.019158253574260063 0.01926978868528241 0.019381973129029294 0.019494810685772086 0.019608305157790065 0.019722460369498523 0.01983728016757768 0.019952768421102253 0.020068929021671855 0.02018576588354214 0.020303282943756683 0.020421484162279673 0.02054037352212932 0.020659955029512077 0.02078023271395766 0.020901210628454795 0.021022892849587842 0.02114528347767411 0.02126838663690204 0.021392206475470212 0.021516747165727084 0.0216420129043116 0.02176800791229461 0.021894736435321097 0.022022202743753275 0.02215041113281444 0.02227936592273372 0.022409071458891684 0.02253953211196671 0.02267075227808235 0.022802736378955368 0.022935488862044804 0.023069014200701815 0.023203316894320404 0.023338401468489096 0.023474272475143342 0.02361093449271897 0.023748392126306455 0.023886650007806067 0.024025712796084016 0.02416558517712936 0.024306271864211963 0.0244477775980413 0.0245901071469262 0.024733265306935558 0.024877256902059892 0.025022086784373936 0.025167759834200124 0.025314280960273036 0.025461655099904862 0.025609887219151684 0.025758982312980867 0.025908945405439424 0.02605978154982316 0.02621149582884715 0.026364093354816848 0.026517579269800425 0.02667195874580208 0.02682723698493622 0.026983419219602837 0.027140510712663792 0.027298516757620152 0.027457442678790613 0.027617293831490832 0.02777807560221395 0.02793979340881208 0.02810245270067884 0.028266058958933072 0.028430617696603426 0.0285961344588142 0.028762614822972182 0.02893006439895457 0.029098488829298066 0.029267893789388936 0.02943828498765429 0.029609668165754454 0.029782049098776398 0.029955433595428425 0.030129827498235805 0.030305236683737708 0.030481667062685215 0.03065912458024048 0.03083761521617712 0.031017144985081617 0.03119771993655607 0.03137934615542202 0.03156202976192546 0.03174577691194317 0.03193059379719003 0.0321164866454277 0.03230346172067456 0.03249152532341662 0.032680683790820016 0.03287094349694441 0.03306231085295782 0.03325479230735274 0.033448394346163236 0.03364312349318376 0.033838986310188765 0.03403598939715391 0.03423413939247852 0.034433442973209084 0.03463390685526451 0.03483553779366223 0.035038342582745886 0.03524232805641433 0.03544750108835181 0.03565386859225968 0.035861437522089305 0.03607021487227642 0.03628020767797686 0.03649142301530351 0.03670386800156487 0.0369175497955048 0.0371324755975438 0.03734865265002164 0.037566088237441356 0.037784789686714754 0.038004764367409356 0.03822601969199655 0.03844856311610163 0.03867240213875481 0.038897544302643985 0.039123997194369 0.03935176844469708 0.03958086572882019 0.039811296766613526 0.04004306932289565 0.040276191207690284 0.040510670276489226 0.04074651443051736 0.04098373161699867 0.0412223298294241 0.041462317107821035 0.04170370153902395 0.041946491256947264 0.04219069444285912 0.04243631932565721 0.04268337418214614 0.042931867337316076 0.043181807164623595 0.04343320208627359 0.04368606057350317 0.04394039114686717 0.04419620237652517 0.044453502882530305 0.044712301335119775 0.044972606455006954 0.045234427013675346 0.04549777183367402 0.04576264978891498 0.046029069804972254 0.04629704085938245 0.046566571981947566 0.04683767225503899 0.047110350813903676 0.04738461684697208 0.047660479596167475 0.04793794835721774 0.048217032479968336 0.04849774136869744 0.04878008448243295 0.049064071335270985 0.049349711496696765 0.049637014591906864 0.0499259903021336 0.05021664836497138 0.05050899857470458 0.05080305078263788 0.051098814897427985 0.051396300885417606 0.0516955187709714 0.05199647863681346 0.05229919062436748 0.05260366493409813 0.052909911825854965 0.05321794161921817 0.053527764693846173 0.0538393914898255 0.054152832508022546 0.0544680983104374 0.05478519952055985 0.055104146823727225 0.055424950967484544 0.05574762276194665 0.05607217308016244 0.05639861285848142 0.05672695309692197 0.05705720485954216 0.05738937927481269 0.05772348753599152 0.058059540901501505 0.05839755069530943 0.05873752830730767 0.05907948519369821 0.05942343287737825 0.059769382948328974 0.06011734706400576 0.06046733694973109 0.06081936439908982 0.06117344127432621 0.061529579506744106 0.06188779109710866 0.06224808811605078 0.06261048270447407 0.06297498707396357 0.06334161350719766 0.06371037435836166 0.0640812820535642 0.06445434909125608 0.06482958804265113 0.06520701155215018 0.06558663233776688 0.06596846319155629 0.06635251698004614 0.06673880664467009 0.06712734520220402 0.06751814574520458 0.06791122144245035 0.06830658553938576 0.06870425135856714 0.06910423230011185 0.06950654184214979 0.06991119354127744 0.07031820103301496 0.07072757803226537 0.0711393383337768 0.07155349581260749 0.07197006442459297 0.0723890582068168 0.07281049127808317 0.07323437783939285 0.0736607321744218 0.07408956865000217 0.07452090171660686 0.07495474590883607 0.07539111584590721 0.07583002623214774 0.07627149185749016 0.07671552759797094 0.07716214841623141 0.07761136936202206 0.07806320557270989 0.07851767227378799 0.07897478477938918 0.07943455849280165 0.07989700890698806 0.08036215160510789 0.08083000226104199 0.0813005766399214 0.0817738905986581 0.08224996008647946 0.08272880114546587 0.08321042991109105 0.0836948626127659 0.08418211557438536 0.08467220521487843 0.08516514804876162 0.08566096068669514 0.08615965983604282 0.0866612623014352 0.0871657849853354 0.08767324488860923 0.08818365911109756 0.0886970448521928 0.08921341941141858 0.0897328001890122 0.0902552046865116 0.09078065050734464 0.09130915535742243 0.09184073704573616 0.09237541348495669 0.09291320269203882 0.09345412278882789 0.0939981920026706 0.09454542866702942 0.09509585122209986 0.09564947821543247 0.09620632830255738 0.09676642024761305 0.09732977292397882 0.0978964053149103 0.0984663365141798 0.09903958572671909 0.09961617226926685 0.10019611557101965 0.10077943517428642 0.10136615073514711 0.10195628202411504 0.10254984892680301 0.10314687144459363 0.10374736969531295 0.10435136391390863 0.10495887445313169 0.10556992178422235 0.10618452649759995 0.1068027093035566 0.10742449103295516 0.10804989263793117 0.10867893519259882 0.10931163989376128 0.10994802806162465 0.11058812114051664 0.11123194069960896 0.1118795084336445 0.11253084616366794 0.11318597583776131 0.11384491953178354 0.1145076994501142 0.11517433792640211 0.11584485742431738 0.11651928053830878 0.11719762999436487 0.1178799286507799 0.1185661994989242 0.11925646566401858 0.11995075040591383 0.12064907711987445 0.12135146933736692 0.1220579507268529 0.12276854509458641 0.12348327638541627 0.12420216868359284 0.12492524621357984 0.1256525333408703 0.12638405457280774 0.12711983455941211 0.12785989809421022 0.12860427011507142 0.12935297570504775 0.1301060400932192 0.13086348865554387 0.13162534691571307 0.13239164054601157 0.13316239536818225 0.13393763735429662 0.13471739262762972 0.13550168746354055 0.13629054829035758 0.137084001690269 0.1378820744002186 0.13868479331280678 0.1394921854771968 0.14030427810002608 0.141121098546323 0.14194267434042912 0.14276903316692663 0.14360020287157133 0.1444362114622307 0.1452770871098279 0.14612285814929088 0.14697355308050733 0.14782920056928509 0.1486898294483178 0.14955546871815673 0.1504261475481879 0.1513018952776152 0.15218274141644872 0.1530687156464993 0.1539598478223787 0.15485616797250565 0.15575770630011784 0.15666449318428927 0.15757655918095434 0.15849393502393724 0.15941665162598767 0.16034474007982272 0.1612782316591742 0.16221715781984272 0.16316155020075754 0.1641114406250428 0.16506686110108992 0.16602784382363597 0.1669944211748487 0.16796662572541754 0.16894449023565158 0.16992804765658287 0.1709173311310772 0.1719123739949508 0.17291320977809344 0.1739198722055989 0.17493239519890066 0.17595081287691533 0.17697515955719237 0.17800546975707024 0.17904177819484007 0.18008411979091485 0.18113252966900661 0.18218704315730988 0.1832476957896919 0.1843145233068907 0.1853875616577185 0.18646684700027374 0.18755241570315923 0.18864430434670793 0.1897425497242152 0.19084718884317886 0.19195825892654625 0.1930757974139683 0.19419984196306164 0.19533043045067688 0.19646760097417543 0.197611391852713 0.19876184162853094 0.19991898906825525 0.20108287316420234 0.20225353313569341 0.20343100843037576 0.20461533872555215 0.20580656392951813 0.20700472418290608 0.2082098598600385 0.20942201157028809 0.2106412201594466 0.21186752671110076 0.21310097254801677 0.21434159923353296 0.21558944857296006 0.21684456261499038 0.21810698365311412 0.21937675422704486 0.22065391712415305 0.2219385153809076 0.22323059228432648 0.2245301913734349 0.22583735644073263 0.22715213153366973 0.22847456095613064 0.22980468926992753 0.23114256129630126 0.23248822211743214 0.2338417170779588 0.23520309178650678 0.23657239211722444 0.2379496642113295 0.23933495447866354 0.24072830959925598 0.24212977652489728 0.2435394024807205 0.24495723496679314 0.2463833217597175 0.2478177109142406 0.24926045076487394 0.2507115899275214 0.2521711773011182 0.25363926206927806 0.2551158937019509 0.2566011219570901 0.25809499688232834 0.2595975688166647 0.2611088883921607 0.26262900653564686 0.264157974470438 0.26569584371806 0.2672426660999855 0.2687984937393802 0.2703633790628599 0.2719373748022558 0.2735205339963927 0.2751129099928753 0.27671455644988635 0.27832552733799504 0.2799458769419748 0.28157565986263317 0.28321493101865136 0.28486374564843536 0.2865221593119765 0.28819022789272436 0.28986800759946946 0.2915555549682373 0.2932529268641942 0.2949601804835622 0.29667737335554745 0.29840456334427834 0.3001418086507551 0.30188916781481206 0.30364669971708874 0.3054144635810151 0.3071925189748066 0.3089809258134717 0.31077974436083106 0.3125890352315476 0.31440885939316954 0.31623927816818453 0.3180803532360865 0.31993214663545355 0.32179472076603843 0.3236681383908718 0.32555246263837634 0.3274477570044951 0.32935408535482985 0.33127151192679405 0.333200101331777 0.3351399185573212 0.33709102896931264 0.3390534983141825 0.3410273927211234 0.3430127787043174 0.3450097231651772 0.34701829339460133 0.3490385570752404 0.35107058228377874 0.3531144374932278 0.3551701915752343 0.3572379138023999 0.3593176738506161 0.3614095418014122 0.36351358814431634 0.36562988377923167 0.3677585000188243 0.3698995085909272 0.3720529816409567 0.3742189917343437 0.3763976118589796 0.3785889154276745 0.38079297628063175 0.38300986868793613 0.3852396673520563 0.3874824474103624 0.38973828443765757 0.39200725444872453 0.3942894339008873 0.3965848996965879 0.39889372918597693 0.4012160001695206 0.4035517909006221 0.40590118008825854 0.4082642468996338 0.4106410709628451 0.41303173236956703 0.41543631167775014 0.41785488991433545 0.42028754857798534 0.42273436964182887 0.4251954355562247 0.4276708292515391 0.4301606341409405 0.432664934123211 0.435183813585572 0.43771735740652906 0.4402656509587312 0.4428287801118489 0.44540683123546615 0.44799989120199174 0.4506080473895863 0.4532313876851068 0.4558700004870685 0.45852397470862255 0.4611933997805531 0.4638783656542906 0.4665789628049424 0.4692952822343427 0.4720274154741175 0.47477545458876996 0.4775394921787823 0.4803196213837361 0.48311593588545154 0.48592852991114316 0.4887574982365954 0.4916029361893564 0.49446493965195065 0.4973436050651089 0.5002390294310187 0.5031513103165928 0.5060805458567567 0.5090268347577566 0.5119902763004835 0.5149709703438204 0.5179690173280066 0.5209845182780216 0.5240175748069911 0.527068289119609 0.5301367640155826 0.5332231028930964 0.5363274097522956 0.5394497891987928 0.5425903464471897 0.5457491873246249 0.5489264182743385 0.5521221463592609 0.5553364792656179 0.5585695253065612 0.5618213934258176 0.56509219320136 0.5683820348491004 0.5716910292266033 0.5750192878368212 0.5783669228318522 0.5817340470167187 0.5851207738531702 0.5885272174635041 0.591953492634413 0.5953997148208523 0.5988660001499302 0.602352465424822 0.6058592281287046 0.6093864064287161 0.6129341191799372 0.6165024859293975 0.620091626920102 0.6237016630950842 0.6273327161014811 0.6309849082946323 0.6346583627422037 0.6383532032283332 0.6420695542578029 0.645807541060234 0.6495672895943065 0.6533489265520053 0.6571525793628864 0.6609783761983734 0.6648264459760748 0.6686969183641299 0.6725899237855766 0.6765055934227466 0.6804440592216867 0.6844054538966036 0.6883899109343378 0.6923975645988597 0.6964285499357953 0.7004830027769761 0.704561059745016 0.7086628582579172 0.7127885365336972 0.716938233595049 0.7211120892740251 0.7253102442167485 0.729532839888154 0.733780018576753 0.7380519233994293 0.7423486983062613 0.7466704880853737 0.7510174383678151 0.7553896956324654 0.7597874072109727 0.7642107212927168 0.7686597869298044 0.7731347540420893 0.777635773422226 0.7821629967407505 0.7867165765511906 0.7912966662952082 0.7959034203077674 0.8005369938223366 0.8051975429761191 0.8098852248153143 0.8146001973004106 0.8193426193115064 0.8241126506536653 0.8289104520623002 0.8337361852085909 0.8385900127049305 0.8434720981104049 0.8483826059363058 0.8533217016516718 0.8582895516888677 0.863286323449189 0.8683121853085051 0.873367306622932 0.8784518577345398 0.8835660099770932 0.8887099356818229 0.8938838081832344 0.8990878018249485 0.9043220919655751 0.9095868549846248 0.9148822682884491 0.9202085103162206 0.9255657605459447 0.9309541995005096 0.9363740087537661 0.9418253709366483 0.9473084697433275 0.9528234899374007 0.9583706173581199 0.9639500389266498 0.9695619426523698 0.9752065176392081 0.9808839540920136 0.9865944433229672 0.9923381777580255 0.998115350943407 1.0039261575521128 1.009770793390489 1.0156494554048199 1.0215623416879698 1.0275096514860564 1.033491585205161 1.0395083444180884 1.0455601318711518 1.051647151491012 1.0577696083915453 1.0639277088807524 1.0701216604677177 1.076351671869594 1.082617953018641 1.0889207150692992 1.0952601704052987 1.1016365326468263 1.1080500166577125 1.1145008385526824 1.1209892157046317 1.1275153667519506 1.1340795116058977 1.1406818714580016 1.1473226687875226 1.1540021273689463 1.16072047227952 1.1674779299068452 1.1742747279564982 1.1811110954597095 1.1879872627810788 1.1949034616263343 1.2018599250501467 1.2088568874639802 1.2158945846439864 1.2229732537389582 1.2300931332783118 1.2372544631801323 1.244457484759255 1.251702440735393 1.2589895752413245 1.26631913383111 1.2736913634883749 1.2811065126346288 1.2885648311376325 1.2960665703198269 1.3036119829667905 1.3112013233357684 1.3188348471642348 1.3265128116785065 1.3342354756024208 1.3420030991660423 1.3498159441144413 1.3576742737165102 1.3655783527738303 1.3735284476296052 1.3815248261776234 1.3895677578712962 1.3976575137327327 1.4057943663618693 1.4139785899456638 1.4222104602673242 1.4304902547156118 1.4388182522941837 1.44719473363099 1.4556199809877413 1.464094278269406 1.4726179110337903 1.481191166501154 1.489814333563885 1.4984877027962438 1.5072115664641497 1.5159862185350246 1.5248119546877101 1.5336890723224186 1.5426178705707647 1.5515986503058417 1.5606317141523542 1.5697173664968278 1.5788559134978517 1.5880476630964087 1.5972929250262446 1.6065920108243026 1.6159452338412308 1.6253529092519294 1.634815354066182 1.6443328871393326 1.6539058291830253 1.663534502776024 1.6732192323750672 1.6829603443258139 1.6927581668738356 1.7026130301756714 1.7125252663099657 1.7224952092886443 1.7325231950681816 1.7426095615609165 1.7527546486464334 1.762958798183027 1.773222354019209 1.7835456620053054 1.7939290700051072 1.8043729279075853 1.8148775876386942 1.8254434031732165 1.8360707305467023 1.8467599278674625 1.8575113553286293 1.8683253752203057 1.879202351941767 1.8901426520137352 1.9011466440907419 1.9122146989735362 1.9233471896215935 1.9345444911656755 1.9458069809204677 1.9571350383973047 1.9685290453169453 1.9799893856224473 1.9915164454921002 2.003110613352432 2.0147722798913117 2.026501838071099 2.0382996831418994 2.0501662126548768 2.062101826475644 2.0741069267977514 2.0861819181562224 2.0983272074412 2.110543203911652 2.1228303192091547 2.1351889673717785 2.1476195648480245 2.16012253051087 2.1726982856718795 2.1853472540953915 2.1980698620128174 2.210866538136983 2.223737713676594 2.2366838223507557 2.2497053004035843 2.2628025866189194 2.275976122335103 2.289226351459844 2.302553720485193 2.3159586785025694 2.3294416772179107 2.3430031709668855 2.3566436167301976 2.370363474149001 2.3841632055403688 2.398043275912889 2.4120041529823264 2.426046307187377 2.4401702117055355 2.4543763424690224 2.4686651781808364 2.4830372003308803 2.497492893212176 2.512032743937204 2.526657242454293 2.5413668815641515 2.5561621569364656 2.571043567126591 2.586011613592374 2.6010668007110263 2.6162096357961406 2.631440629114776 2.6467602939046464 2.6621691463914328 2.677667705806156 2.693256494402694 2.7089360374753717 2.7247068633766514 2.7405695035349584 2.756524492472566 2.7725723678236256 2.7887136703522755 2.8049489439708557 2.82127873575825 2.8377035959783163 2.8542240780984174 2.870840738808092 2.8875541380377903 2.904364838977763 2.9212734080970297 2.9382804151624575 2.955386433257983 2.972592038803898 2.989897811576295 3.0073043347265944 3.0248121948011857 3.042421981761214 3.060134289002436 3.0779497133752356 3.0958688552047273 3.113892318310977 3.1320207100293693 3.1502546412310486 3.168594726343525 3.18704158337137 3.205595833917031 3.2242581032018003 3.2430290200868575 3.2619092170944812 3.2808993304293566 3.2999999999999994
.backanno
.end